# Altium schematic sheet Radio.SchDoc
size A
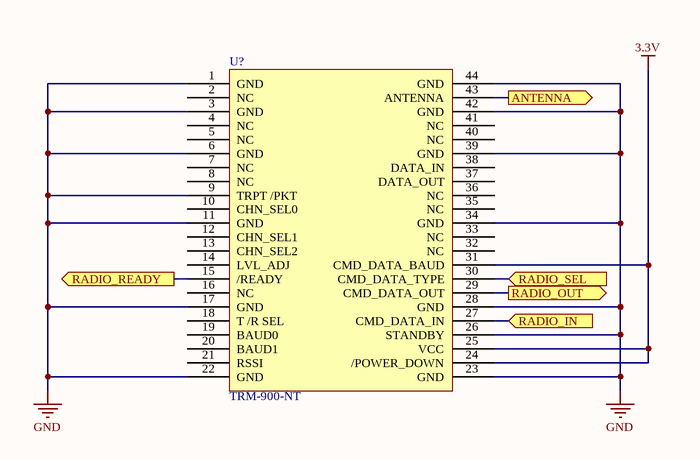
[diagram p0: Radio.SchDoc]

## Parts
U?  TRM-900-NT  [TRM-900-NT]

## Ports
ANTENNA (out), RADIO_IN (in), RADIO_OUT (out), RADIO_READY (out), RADIO_SEL (in)

## Nets
3.3V: U?.24(/POWER_DOWN) U?.25(VCC) U?.31(CMD_DATA_BAUD)
GND: U?.1(GND) U?.3(GND) U?.6(GND) U?.9(TRPT_/PKT) U?.11(GND) U?.17(GND) U?.22(GND) U?.23(GND) U?.26(STANDBY) U?.28(GND) U?.34(GND) U?.39(GND) U?.42(GND) U?.44(GND)
ANTENNA: U?.43(ANTENNA) ; port ANTENNA
RADIO_IN: U?.27(CMD_DATA_IN) ; port RADIO_IN
RADIO_OUT: U?.29(CMD_DATA_OUT) ; port RADIO_OUT
RADIO_READY: U?.15(/READY) ; port RADIO_READY
RADIO_SEL: U?.30(CMD_DATA_TYPE) ; port RADIO_SEL

Not connected (* = marked no-connect by the designer): U? 2(NC) 4(NC) 5(NC) 7(NC) 8(NC) 10(CHN_SEL0) 12(CHN_SEL1) 13(CHN_SEL2) 14(LVL_ADJ) 16(NC) 18(T_/R_SEL) 19(BAUD0) 20(BAUD1) 21(RSSI) 32(NC) 33(NC) 35(NC) 36(NC) 37(DATA_OUT) 38(DATA_IN) 40(NC) 41(NC)

## Library data of the parts
U? = TRM-900-NT: RF TXRX MODULE ISM<1GHZ; Manufacturer: Linx; Supplier 1: Digi-Key; Supplier 1 Part Number: TRM-900-NT-ND; Manufacturer Part Number: TRM-900-NT